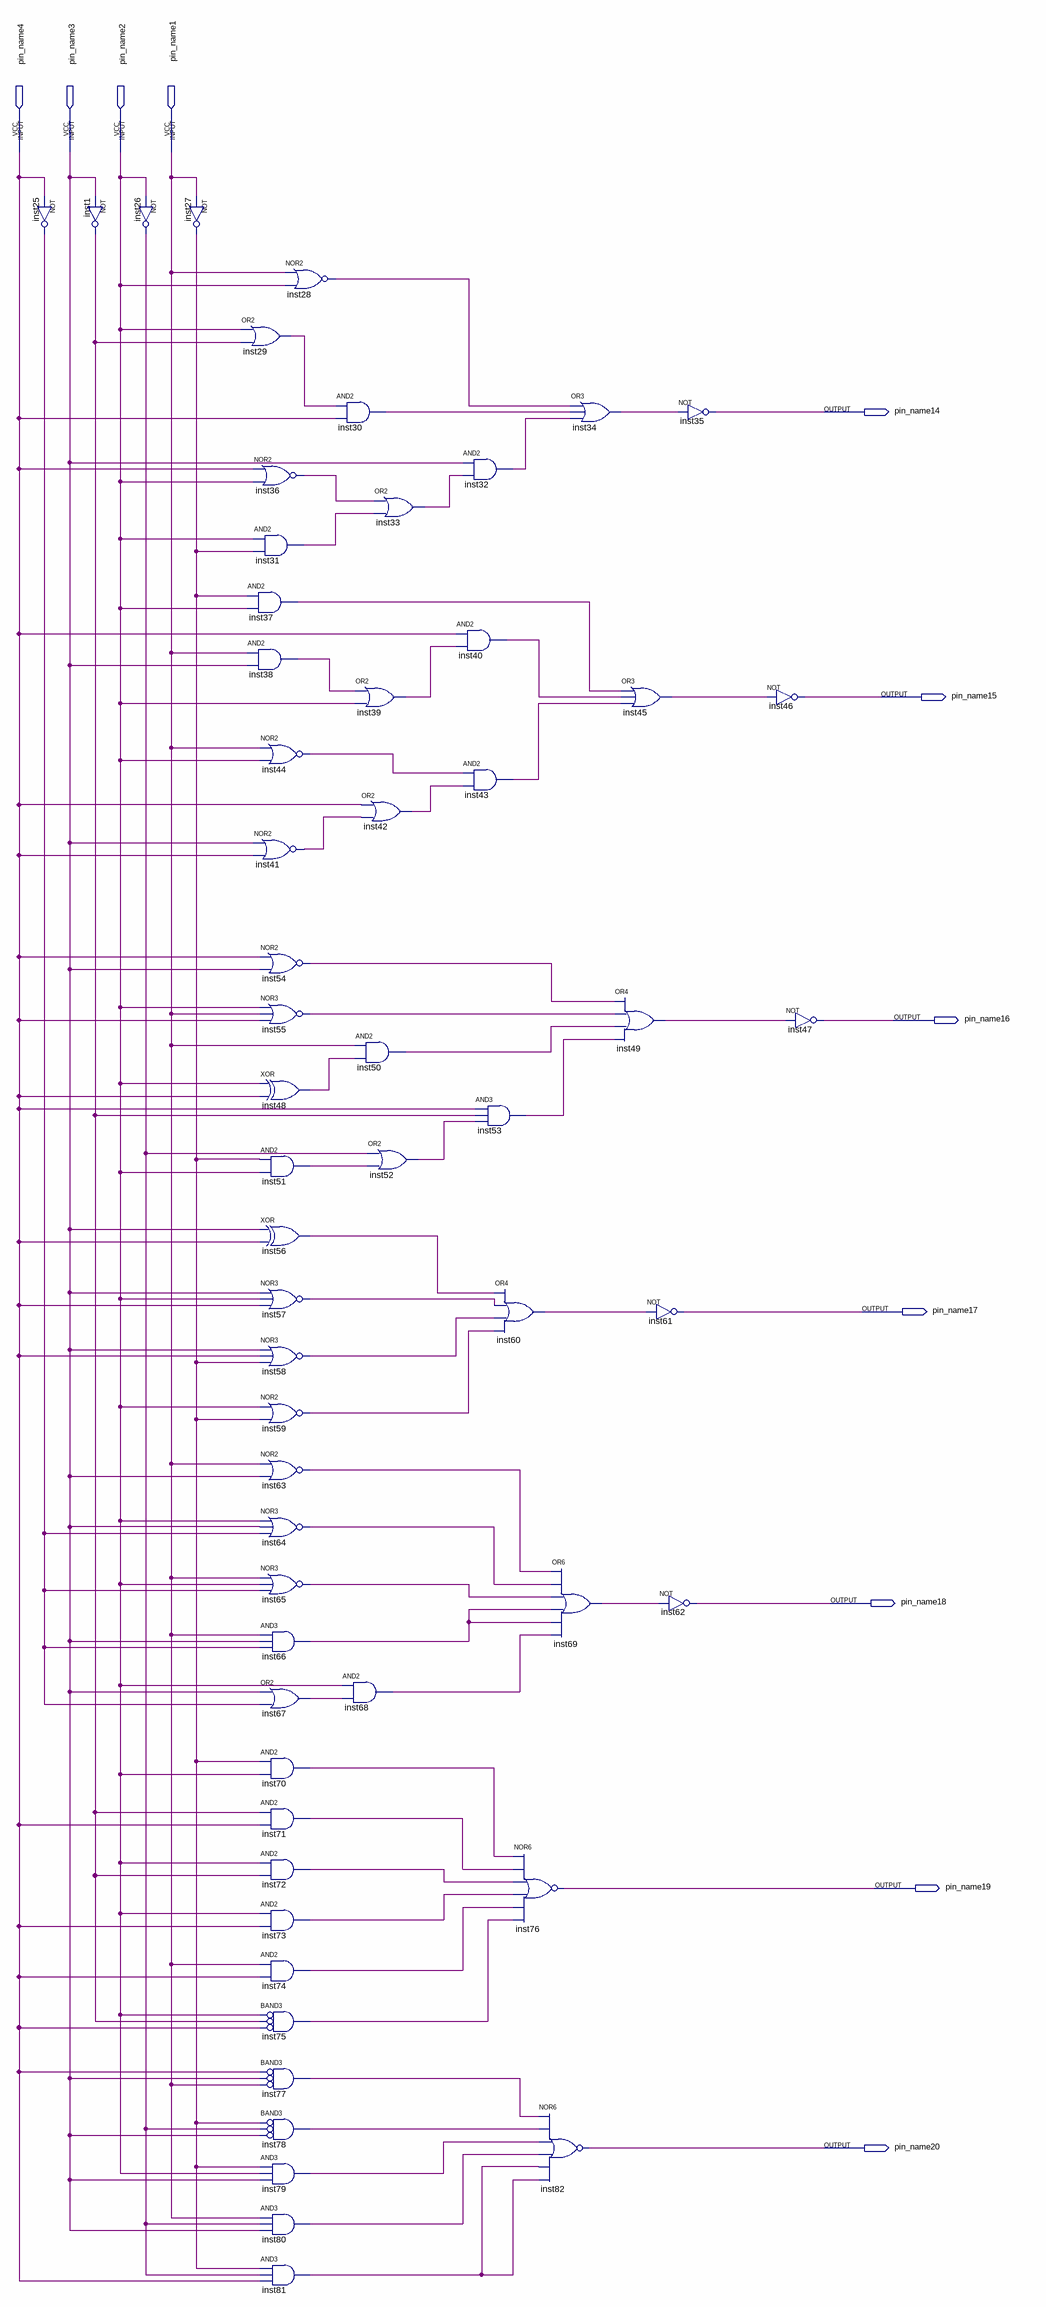
[diagram p0: schematic sheet]
// Quartus schematic display.bdf as structural Verilog: 59 symbols, 11 pins
module display (
  input  pin_name4,
  input  pin_name3,
  input  pin_name2,
  input  pin_name1,
  output pin_name14,
  output pin_name15,
  output pin_name16,
  output pin_name17,
  output pin_name18,
  output pin_name19,
  output pin_name20
);

  wire inst1_out, inst25_out, inst26_out, inst27_out, inst28_out, inst29_out, inst30_out, inst31_out,
       inst32_out, inst33_out, inst34_out, inst36_out, inst37_out, inst38_out, inst39_out, inst40_out,
       inst41_out, inst42_out, inst43_out, inst44_out, inst45_out, inst48_out, inst49_out, inst50_out,
       inst51_out, inst52_out, inst53_out, inst54_out, inst55_out, inst56_out, inst57_out, inst58_out,
       inst59_out, inst60_out, inst63_out, inst64_out, inst65_out, inst66_out, inst67_out, inst68_out,
       inst69_out, inst70_out, inst71_out, inst72_out, inst73_out, inst74_out, inst75_out, inst77_out,
       inst78_out, inst79_out, inst80_out, inst81_out;

  not inst25 (inst25_out, pin_name4);
  not inst1 (inst1_out, pin_name3);
  not inst26 (inst26_out, pin_name2);
  not inst27 (inst27_out, pin_name1);
  or inst29 (inst29_out, pin_name2, inst1_out);
  and inst37 (inst37_out, inst27_out, pin_name2);
  and inst38 (inst38_out, pin_name1, pin_name3);
  nor inst28 (inst28_out, pin_name1, pin_name2);
  nor inst36 (inst36_out, pin_name4, pin_name2);
  and inst31 (inst31_out, pin_name2, inst27_out);
  nor inst44 (inst44_out, pin_name1, pin_name2);
  nor inst41 (inst41_out, pin_name3, pin_name4);
  nor inst54 (inst54_out, pin_name4, pin_name3);
  nor inst55 (inst55_out, pin_name2, pin_name1, pin_name4);
  xor inst48 (inst48_out, pin_name2, pin_name4);
  and inst51 (inst51_out, inst27_out, pin_name2);
  xor inst56 (inst56_out, pin_name3, pin_name4);
  nor inst57 (inst57_out, pin_name3, pin_name2, pin_name4);
  nor inst58 (inst58_out, pin_name3, pin_name4, inst27_out);
  nor inst59 (inst59_out, pin_name2, inst27_out);
  nor inst63 (inst63_out, pin_name1, pin_name3);
  nor inst64 (inst64_out, pin_name2, pin_name3, inst25_out);
  nor inst65 (inst65_out, pin_name1, pin_name2, inst25_out);
  and inst66 (inst66_out, pin_name1, pin_name3, inst25_out);
  or inst67 (inst67_out, pin_name3, inst25_out);
  and inst70 (inst70_out, inst27_out, pin_name2);
  and inst71 (inst71_out, inst1_out, pin_name4);
  and inst72 (inst72_out, pin_name2, inst1_out);
  and inst73 (inst73_out, pin_name2, pin_name4);
  and inst74 (inst74_out, pin_name1, pin_name4);
  and inst75 (inst75_out, ~pin_name2, ~inst1_out, ~pin_name4);  // BAND3
  and inst77 (inst77_out, ~pin_name4, ~pin_name3, ~pin_name1);  // BAND3
  and inst78 (inst78_out, ~inst27_out, ~inst26_out, ~pin_name3);  // BAND3
  and inst79 (inst79_out, inst27_out, pin_name2, pin_name3);
  and inst80 (inst80_out, pin_name1, inst26_out, pin_name3);
  and inst81 (inst81_out, inst27_out, inst26_out, pin_name4);
  and inst30 (inst30_out, inst29_out, pin_name4);
  and inst68 (inst68_out, pin_name2, inst67_out);
  or inst33 (inst33_out, inst36_out, inst31_out);
  or inst39 (inst39_out, inst38_out, pin_name2);
  or inst42 (inst42_out, pin_name4, inst41_out);
  and inst50 (inst50_out, pin_name1, inst48_out);
  or inst52 (inst52_out, inst26_out, inst51_out);
  and inst32 (inst32_out, pin_name3, inst33_out);
  and inst40 (inst40_out, pin_name4, inst39_out);
  and inst43 (inst43_out, inst44_out, inst42_out);
  and inst53 (inst53_out, pin_name4, inst1_out, inst52_out);
  or inst60 (inst60_out, inst56_out, inst57_out, inst58_out, inst59_out);
  or inst69 (inst69_out, inst63_out, inst64_out, inst65_out, inst66_out, inst66_out, inst68_out);
  nor inst76 (pin_name19, inst70_out, inst71_out, inst72_out, inst73_out, inst74_out, inst75_out);
  nor inst82 (pin_name20, inst77_out, inst78_out, inst79_out, inst80_out, inst81_out, inst81_out);
  or inst34 (inst34_out, inst28_out, inst30_out, inst32_out);
  or inst45 (inst45_out, inst37_out, inst40_out, inst43_out);
  or inst49 (inst49_out, inst54_out, inst55_out, inst50_out, inst53_out);
  not inst61 (pin_name17, inst60_out);
  not inst35 (pin_name14, inst34_out);
  not inst62 (pin_name18, inst69_out);
  not inst46 (pin_name15, inst45_out);
  not inst47 (pin_name16, inst49_out);
endmodule
